# Altium schematic sheet MCU_DBG.SchDoc
size A4
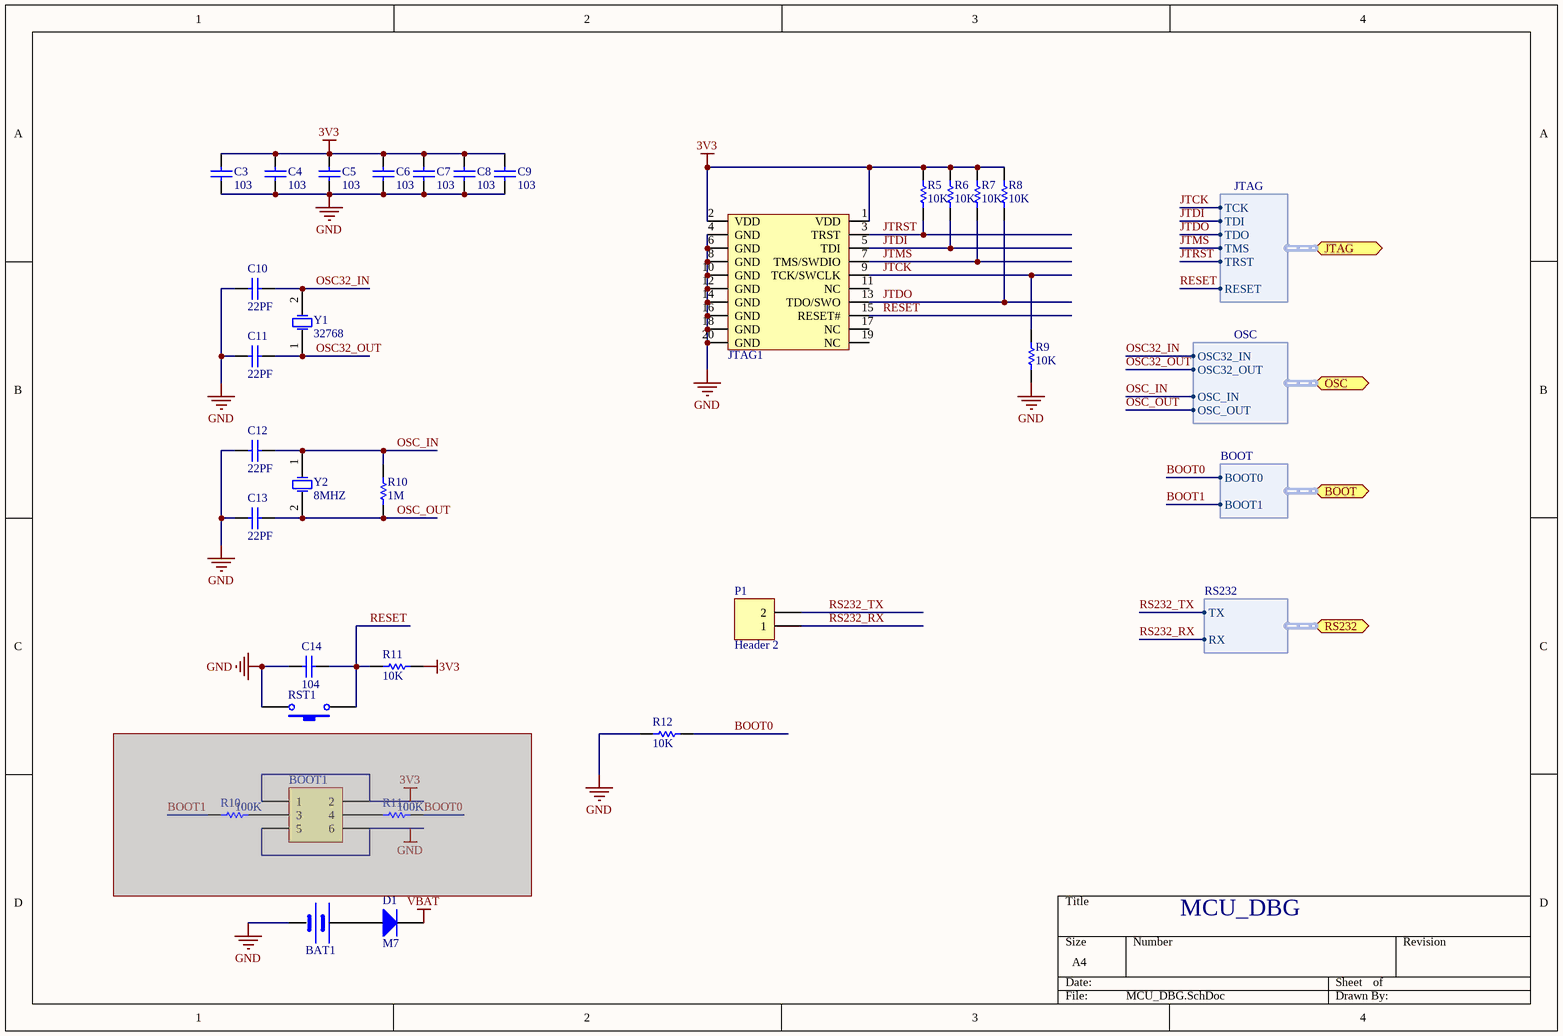
[diagram p0: MCU_DBG.SchDoc]

## Parts
(Parts that share a designator on the sheet are numbered #1, #2 ... from top to bottom, then left to right.)
BAT1  BATT  [Bat2032]  (value not drawn)
BOOT1  BOOT  [HDR2X3]  (value not drawn)  (masked out: inside a compile mask, not in the netlist)
C3  value 103  [RC0805]  (hidden comment: Cap)
C4  value 103  [RC0805]  (hidden comment: Cap)
C5  value 103  [RC0805]  (hidden comment: Cap)
C6  value 103  [RC0805]  (hidden comment: Cap)
C7  value 103  [RC0805]  (hidden comment: Cap)
C8  value 103  [RC0805]  (hidden comment: Cap)
C9  value 103  [RC0805]  (hidden comment: Cap)
C10  value 22PF  [RC0805]  (hidden comment: Cap)
C11  value 22PF  [RC0805]  (hidden comment: Cap)
C12  value 22PF  [RC0805]  (hidden comment: Cap)
C13  value 22PF  [RC0805]  (hidden comment: Cap)
C14  value 104  [RC0805]  (hidden comment: Cap)
D1  M7  [ss14]
JTAG1  JTAG  [JTAG_20]  (value not drawn)
P1  Header 2  [HDR1X2]
R5  value 10K  [RC0805]  (hidden comment: Res1)
R6  value 10K  [RC0805]  (hidden comment: Res1)
R7  value 10K  [RC0805]  (hidden comment: Res1)
R8  value 10K  [RC0805]  (hidden comment: Res1)
R9  value 10K  [RC0805]  (hidden comment: Res1)
R10#1  value 1M  [RC0805]  (hidden comment: Res1)
R10#2  value 100K  [RC0805]  (hidden comment: Res1)  (masked out: inside a compile mask, not in the netlist)
R11#1  value 10K  [RC0805]  (hidden comment: Res1)
R11#2  value 100K  [RC0805]  (hidden comment: Res1)  (masked out: inside a compile mask, not in the netlist)
R12  value 10K  [RC0805]  (hidden comment: Res1)
RST1  SW-PB  [KEY2*2(COMMON)]  (value not drawn)
Y1  32768  [XTAL32]
Y2  8MHZ  [OSC]

## Ports
BOOT (harness BOOT), JTAG (harness JTAG), OSC (harness OSC), RS232 (harness RS232)

## Harnesses
JTAG: TCK, TDI, TDO, TMS, TRST, RESET
OSC: OSC32_IN, OSC32_OUT, OSC_IN, OSC_OUT
BOOT: BOOT0, BOOT1
RS232: TX, RX

## Nets
3V3: C3.1 C4.1 C5.1 C6.1 C7.1 C8.1 C9.1 JTAG1.1(VDD) JTAG1.2(VDD) R5.2 R6.2 R7.2 R8.2 R11#1.2
GND: BAT1.2(GND) C3.2 C4.2 C5.2 C6.2 C7.2 C8.2 C9.2 C10.1 C11.1 C12.1 C13.1 C14.2 JTAG1.4(GND) JTAG1.6(GND) JTAG1.8(GND) JTAG1.10(GND) JTAG1.12(GND) JTAG1.14(GND) JTAG1.16(GND) JTAG1.18(GND) JTAG1.20(GND) R9.2 R12.1 RST1.2
VBAT: D1.2(K)
BOOT0: R12.2 ; port BOOT.BOOT0
BOOT1: port BOOT.BOOT1
JTCK: JTAG1.9(TCK/SWCLK) R9.1 ; port JTAG.TCK
JTDI: JTAG1.5(TDI) R6.1 ; port JTAG.TDI
JTDO: JTAG1.13(TDO/SWO) R8.1 ; port JTAG.TDO
JTMS: JTAG1.7(TMS/SWDIO) R7.1 ; port JTAG.TMS
JTRST: JTAG1.3(TRST) R5.1 ; port JTAG.TRST
OSC32_IN: C10.2 Y1.2(OSC2) ; port OSC.OSC32_IN
OSC32_OUT: C11.2 Y1.1(OSC1) ; port OSC.OSC32_OUT
OSC_IN: C12.2 R10#1.2 Y2.1(OSC1) ; port OSC.OSC_IN
OSC_OUT: C13.2 R10#1.1 Y2.2(OSC2) ; port OSC.OSC_OUT
RESET: C14.1 JTAG1.15(RESET#) R11#1.1 RST1.1 ; port JTAG.RESET
RS232_RX: P1.1 ; port RS232.RX
RS232_TX: P1.2 ; port RS232.TX
NetBAT1_1: BAT1.1(VCC) D1.1(A)

Not connected (* = marked no-connect by the designer): JTAG1 11(NC) 17(NC) 19(NC)

## Notes on the sheet
- MCU_DBG

## Library data of the parts
BAT1 = BAT
BOOT1 = Header 3X2: Header, 3-Pin, Dual row; LatestRevisionDate: 17-Jul-2002; LatestRevisionNote: Re-released for DXP Platform.; Publisher: Altium Limited
C3-C14 = Cap: Capacitor; Published: 8-Jun-2000; LatestRevisionDate: 17-Jul-2002; LatestRevisionNote: Re-released for DXP Platform.; PackageReference: RAD-0.3; Publisher: Altium Limited; PackageDescription: Radial Cap, Thru-Hole; 2 Leads; 0.3 in Pin Spacing
D1 = Diode: Default Diode; Published: 8-Jun-2000; LatestRevisionDate: 17-Jul-2002; LatestRevisionNote: Re-released for DXP Platform.; PackageVersion: Sep-1996; PackageReference: SMC; Publisher: Altium Limited; PackageDescription: DO-214-AB/SMC; 2 C-Bend Leads; Body 7.9 x 5.9 mm, inc. leads (LxW); Code_JEDEC: DO-214-AB
P1 = Header 2: Header, 2-Pin; LatestRevisionDate: 17-Jul-2002; LatestRevisionNote: Re-released for DXP Platform.; Publisher: Altium Limited
R5-R9 R10#1 R10#2 R11#1 R11#2 R12 = Res1: Resistor; Published: 8-Jun-2000; LatestRevisionDate: 17-Jul-2002; LatestRevisionNote: Re-released for DXP Platform.; PackageReference: AXIAL-0.3; Publisher: Altium Limited; PackageDescription: Axial Device, Thru-Hole; 2 Leads; 0.3 in Pin Spacing
RST1 = SW-PB: Switch; Published: 24-Mar-1999; LatestRevisionDate: 17-Jul-2002; LatestRevisionNote: Re-released for DXP Platform.; PackageReference: SPST-2; Publisher: Altium Limited; PackageDescription: Switch; 2 Leads
Y1 Y2 = XTAL: Crystal Oscillator; Published: 8-Jun-2000; LatestRevisionDate: 17-Jul-2002; LatestRevisionNote: Re-released for DXP Platform.; Publisher: Altium Limited
  Y1: PackageReference: R38; PackageDescription: Crystal, Thru-Hole; 2 Leads; Body 3.1 x 8.2 mm (Dia.xH)